# EAGLE design v2.0 Main (EAGLE 9.7.0)
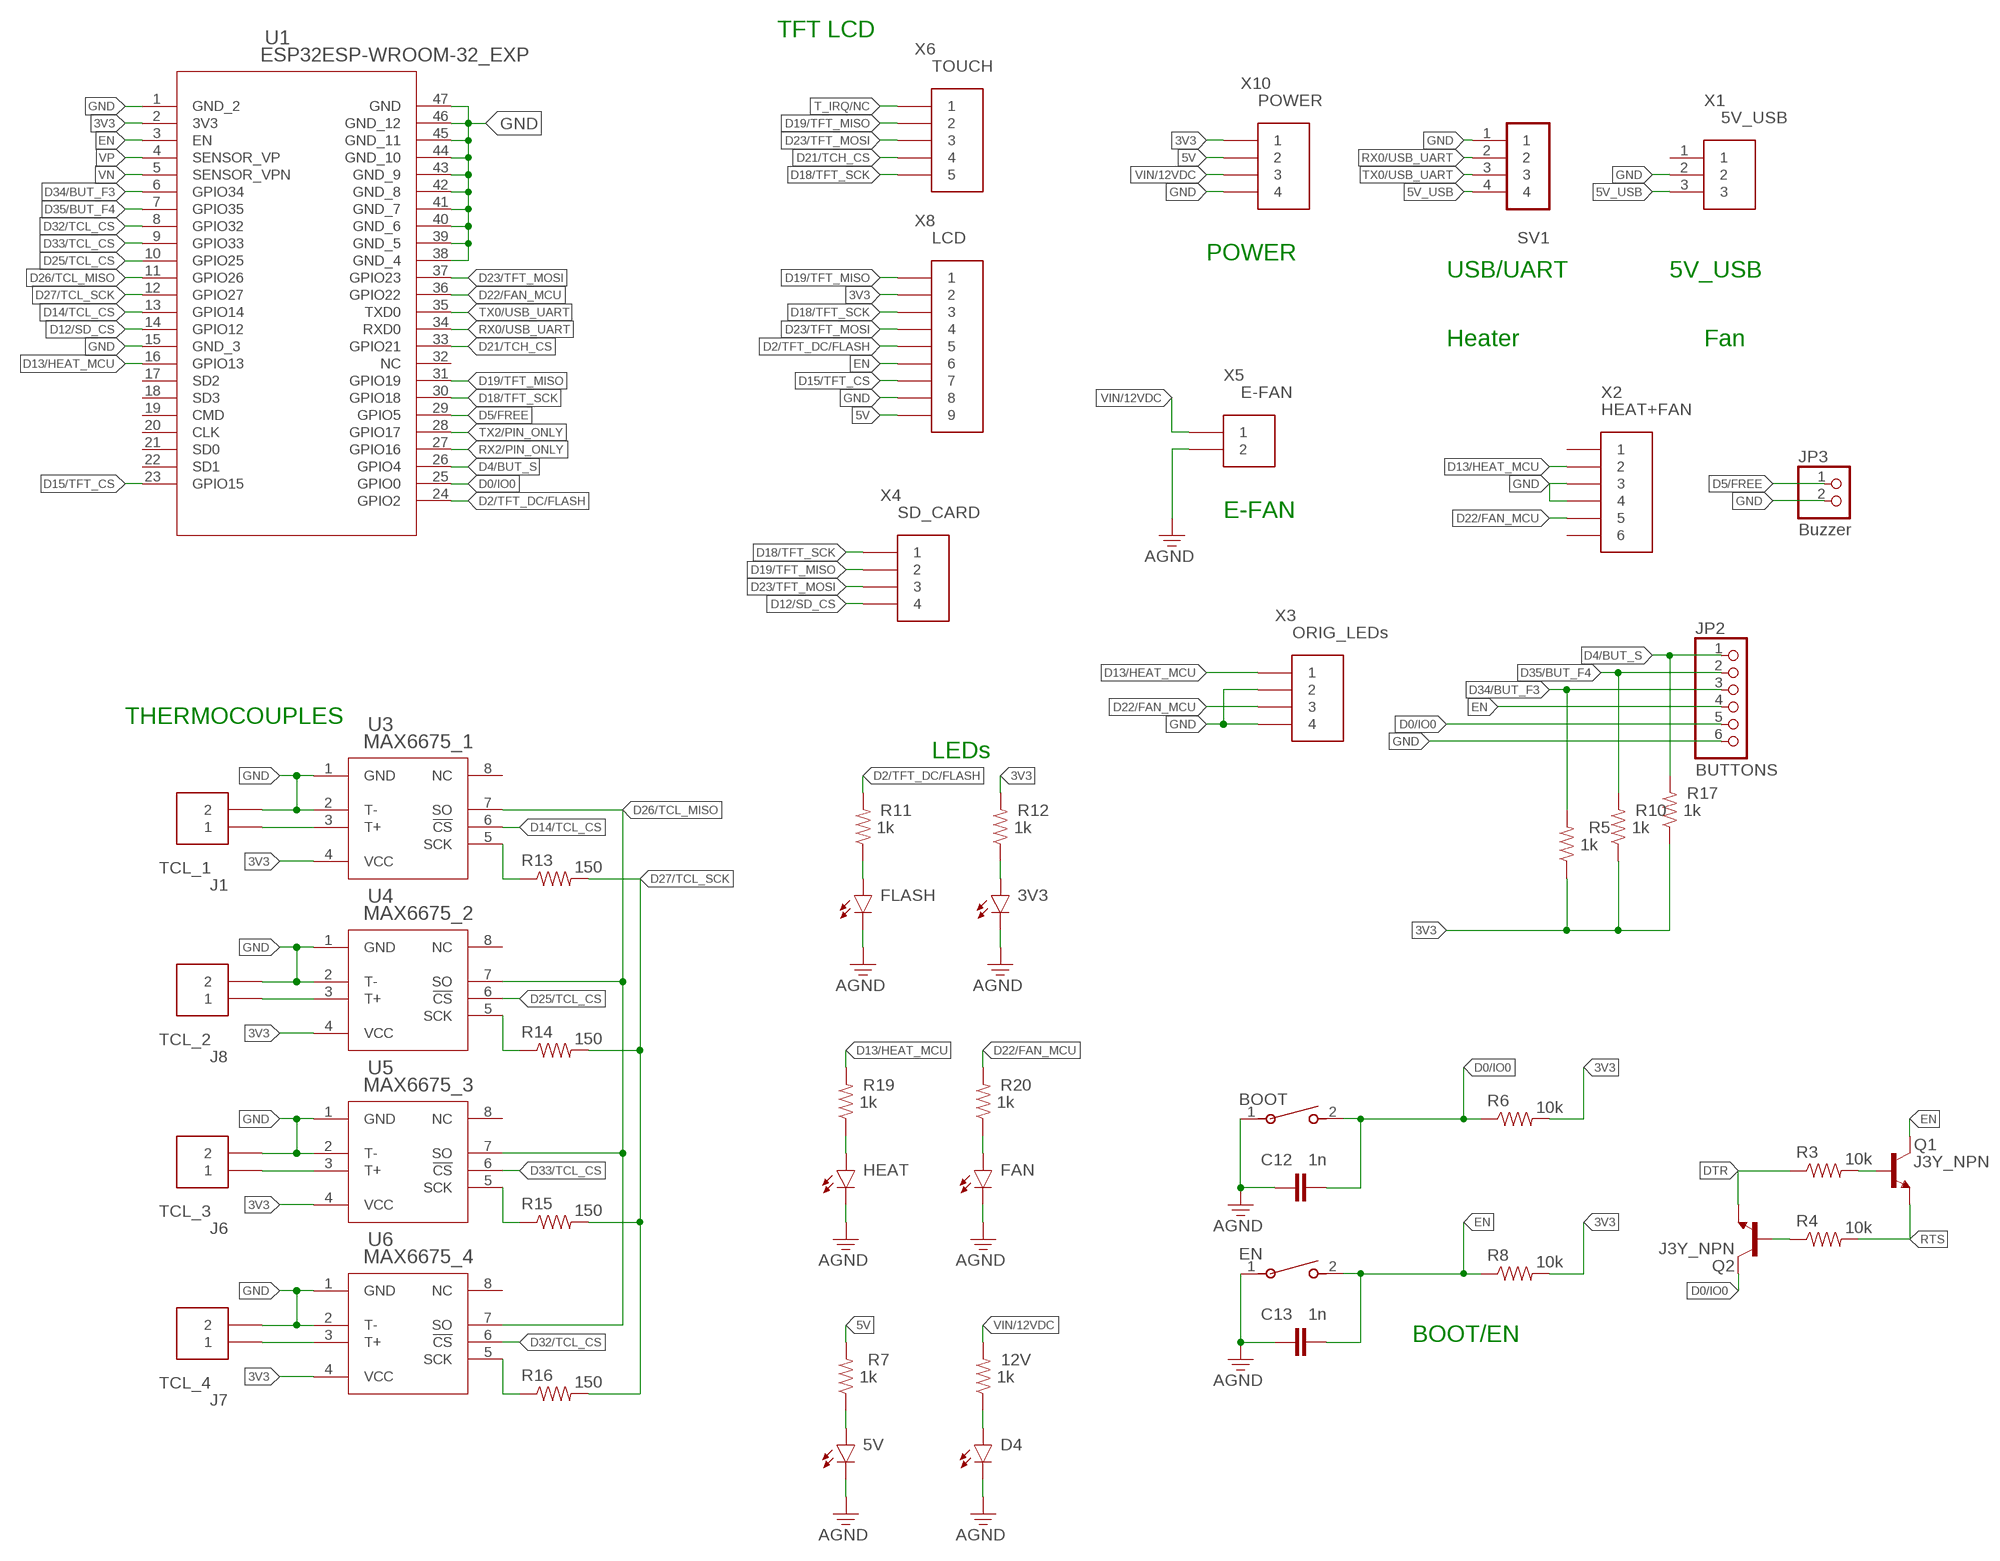
[diagram p0: schematic, sheet 1]

## Parts
3V3  LED  CHIP-FLAT-B_0805  [LEDC2012X110N_FLAT-B]
5V  LED  CHIP-FLAT-B_0805  [LEDC2012X110N_FLAT-B]
12V  1k  R-US_CHIP-0805(2012-METRIC)  [RESC2012X65]
BOOT  EVQ22705RSW_EVQ22705R_PAN  [SW_EVQ22705R_PAN]
C12  1n  C_CHIP-0805(2012-METRIC)  [CAPC2012X110]
C13  1n  C_CHIP-0805(2012-METRIC)  [CAPC2012X110]
D4  LED  CHIP-FLAT-B_0805  [LEDC2012X110N_FLAT-B]
EN  EVQ22705RSW_EVQ22705R_PAN  [SW_EVQ22705R_PAN]
FAN  LED  CHIP-FLAT-B_0805  [LEDC2012X110N_FLAT-B]
FLASH  LED  CHIP-FLAT-B_0805  [LEDC2012X110N_FLAT-B]
HEAT  LED  CHIP-FLAT-B_0805  [LEDC2012X110N_FLAT-B]
J1  TCL_1  OSTVN02A150CONN_OSTVN02A150_OST  [CONN_OSTVN02A150_OST]
J6  TCL_3  OSTVN02A150CONN_OSTVN02A150_OST  [CONN_OSTVN02A150_OST]
J7  TCL_4  OSTVN02A150CONN_OSTVN02A150_OST  [CONN_OSTVN02A150_OST]
J8  TCL_2  OSTVN02A150CONN_OSTVN02A150_OST  [CONN_OSTVN02A150_OST]
JP2  BUTTONS  PINHD-1X6  [1X06]
JP3  Buzzer  PINHD-1X2  [1X02]
Q1  J3Y_NPN  NPN_SC59-BEC  [SC59]
Q2  J3Y_NPN  NPN_SC59-BEC  [SC59]
R3  10k  R-US_CHIP-0805(2012-METRIC)  [RESC2012X65]
R4  10k  R-US_CHIP-0805(2012-METRIC)  [RESC2012X65]
R5  1k  R-US_CHIP-0805(2012-METRIC)  [RESC2012X65]
R6  10k  R-US_CHIP-0805(2012-METRIC)  [RESC2012X65]
R7  1k  R-US_CHIP-0805(2012-METRIC)  [RESC2012X65]
R8  10k  R-US_CHIP-0805(2012-METRIC)  [RESC2012X65]
R10  1k  R-US_CHIP-0805(2012-METRIC)  [RESC2012X65]
R11  1k  R-US_CHIP-0805(2012-METRIC)  [RESC2012X65]
R12  1k  R-US_CHIP-0805(2012-METRIC)  [RESC2012X65]
R13  150  R-US_CHIP-0805(2012-METRIC)  [RESC2012X65]
R14  150  R-US_CHIP-0805(2012-METRIC)  [RESC2012X65]
R15  150  R-US_CHIP-0805(2012-METRIC)  [RESC2012X65]
R16  150  R-US_CHIP-0805(2012-METRIC)  [RESC2012X65]
R17  1k  R-US_CHIP-0805(2012-METRIC)  [RESC2012X65]
R19  1k  R-US_CHIP-0805(2012-METRIC)  [RESC2012X65]
R20  1k  R-US_CHIP-0805(2012-METRIC)  [RESC2012X65]
SV1  FEM-HEAD  [FE05-1]
U1  ESP32ESP-WROOM-32_EXP  [ESP32_SCH_PCB]
U3  MAX6675_1  MAX6675_LARGE21-0041B_8_MXM  [21-0041B_8_MXM]
U4  MAX6675_2  MAX6675_LARGE21-0041B_8_MXM  [21-0041B_8_MXM]
U5  MAX6675_3  MAX6675_LARGE21-0041B_8_MXM  [21-0041B_8_MXM]
U6  MAX6675_4  MAX6675_LARGE21-0041B_8_MXM  [21-0041B_8_MXM]
X1  5V_USB  JST-XH-03-PIN-LONG-PAD  [JST-XH-03-PACKAGE-LONG-PAD]
X2  HEAT+FAN  JST-XH-06-PIN-LONG-PAD  [JST-XH-06-PACKAGE-LONG-PAD]
X3  ORIG_LEDs  JST-XH-04-PIN-LONG-PAD  [JST-XH-04-PACKAGE-LONG-PAD]
X4  SD_CARD  JST-XH-04-PIN-LONG-PAD  [JST-XH-04-PACKAGE-LONG-PAD]
X5  E-FAN  JST-XH-02-PIN-LONG-PAD  [-LONG-PAD]
X6  TOUCH  JST-XH-05-PIN-LONG-PAD  [JST-XH-05-PACKAGE-LONG-PAD]
X8  LCD  JST-XH-09-PIN-LONG-PAD  [JST-XH-09-PACKAGE-LONG-PAD]
X10  POWER  JST-XH-04-PIN-LONG-PAD  [JST-XH-04-PACKAGE-LONG-PAD]

## Nets
3V3: R5.1 R6.2 R8.2 R10.1 R12.2 R17.1 U1.2(3V3) U3.4(VCC) U4.4(VCC) U5.4(VCC) U6.4(VCC) X8.2 X10.1
5V: R7.2 X8.9 X10.2
5V_USB: SV1.4 X1.3
D0/IO0: BOOT.2 C12.2 JP2.5 Q2.C R6.1 U1.25(GPIO0)
D2/TFT_DC/FLASH: R11.2 U1.24(GPIO2) X8.5
D4/BUT_S: JP2.1 R17.2 U1.26(GPIO4)
D5/FREE: JP3.1 U1.29(GPIO5)
D12/SD_CS: U1.14(GPIO12) X4.4
D13/HEAT_MCU: R19.2 U1.16(GPIO13) X2.2 X3.1
D14/TCL_CS: U1.13(GPIO14) U3.6(!CS)
D15/TFT_CS: U1.23(GPIO15) X8.7
D18/TFT_SCK: U1.30(GPIO18) X4.1 X6.5 X8.3
D19/TFT_MISO: U1.31(GPIO19) X4.2 X6.2 X8.1
D21/TCH_CS: U1.33(GPIO21) X6.4
D22/FAN_MCU: R20.2 U1.36(GPIO22) X2.5 X3.3
D23/TFT_MOSI: U1.37(GPIO23) X4.3 X6.3 X8.4
D25/TCL_CS: U1.10(GPIO25) U4.6(!CS)
D26/TCL_MISO: U1.11(GPIO26) U3.7(SO) U4.7(SO) U5.7(SO) U6.7(SO)
D27/TCL_SCK: R13.2 R14.2 R15.2 R16.2 U1.12(GPIO27)
D32/TCL_CS: U1.8(GPIO32) U6.6(!CS)
D33/TCL_CS: U1.9(GPIO33) U5.6(!CS)
D34/BUT_F3: JP2.3 R5.2 U1.6(GPIO34)
D35/BUT_F4: JP2.2 R10.2 U1.7(GPIO35)
DTR: Q2.E R3.1
EN: C13.2 EN.2 JP2.4 Q1.C R8.1 U1.3(EN) X8.6
GND: 3V3.C 5V.C BOOT.1 C12.1 C13.1 D4.C EN.1 FAN.C FLASH.C HEAT.C J1.2 J6.2 J7.2 J8.2 JP2.6 JP3.2 SV1.1 U1.1(GND_2) U1.15(GND_3) U1.38(GND_4) U1.39(GND_5) U1.40(GND_6) U1.41(GND_7) U1.42(GND_8) U1.43(GND_9) U1.44(GND_10) U1.45(GND_11) U1.46(GND_12) U1.47(GND) U3.1(GND) U3.2(T-) U4.1(GND) U4.2(T-) U5.1(GND) U5.2(T-) U6.1(GND) U6.2(T-) X1.2 X2.3 X2.4 X3.2 X3.4 X5.2 X8.8 X10.4 ; supply symbol labelled AGND
N$1: FLASH.A R11.1
N$2: Q1.B R3.2
N$4: Q2.B R4.1
N$6: 3V3.A R12.1
N$7: 5V.A R7.1
N$8: 12V.1 D4.A
N$26: HEAT.A R19.1
N$27: FAN.A R20.1
RTS: Q1.E R4.2
RX0/USB_UART: SV1.2 U1.34(RXD0)
RX2/PIN_ONLY: U1.27(GPIO16)
T1: J1.1 U3.3(T+)
T2: J8.1 U4.3(T+)
T3: J6.1 U5.3(T+)
T4: J7.1 U6.3(T+)
T_IRQ/NC: X6.1
TCL_SCK1: R13.1 U3.5(SCK)
TCL_SCK2: R14.1 U4.5(SCK)
TCL_SCK3: R15.1 U5.5(SCK)
TCL_SCK4: R16.1 U6.5(SCK)
TX0/USB_UART: SV1.3 U1.35(TXD0)
TX2/PIN_ONLY: U1.28(GPIO17)
VIN/12VDC: 12V.2 X5.1 X10.3
VN: U1.5(SENSOR_VPN)
VP: U1.4(SENSOR_VP)
Unconnected: U1.17(SD2) U1.18(SD3) U1.19(CMD) U1.20(CLK) U1.21(SD0) U1.22(SD1) U1.32(NC) U3.8(NC) U4.8(NC) U5.8(NC) U6.8(NC) X1.1 X2.1 X2.6

## Notes on the sheet
- TFT LCD
- POWER
- USB/UART | 5V_USB
- Heater | Fan
- E-FAN
- THERMOCOUPLES
- LEDs
- BOOT/EN

## Library data of the parts
3V3 5V D4 FAN FLASH HEAT = LED:CHIP-FLAT-B: Blue LED - Generic; CATEGORY: LED; COLOR: Blue; DESCRIPTION: Blue LED Indication 0805 (2012 Metric); PACKAGE_SIZE: 0805; PACKAGE_TYPE: SMD; SUBCATEGORY: Chip LED; TYPE: Square with Flat Top
12V R3-R8 R10-R17 R19 R20 = Resistor:R-US: Resistor Fixed - ANSI; CATEGORY: Resistors; DESCRIPTION: Chip Resistor 2.00 X 1.25 X 0.65 mm body 0805(2012-METRIC) Package; PACKAGE_SIZE: 0805; PACKAGE_TYPE: SMD
BOOT EN = SD-SolderSync-Library:EVQ22705R; COPYRIGHT: Copyright (C) 2024 Ultra Librarian. All rights reserved.; MANUFACTURER_PART_NUMBER: EVQ-22705R; MFR_NAME: Panasonic
C12 C13 = Capacitor:C: Capacitor - Generic; CATEGORY: Capacitor; PACKAGE_SIZE: 0805; PACKAGE_TYPE: SMD; SUBCATEGORY: Ceramic Capacitors; TYPE: MLCC
J1 J6-J8 = Connectors:OSTVN02A150; COPYRIGHT: Copyright (C) 2025 Ultra Librarian. All rights reserved.; MANUFACTURER_PART_NUMBER: OSTVN02A150; MFR_NAME: On Shore Technology
JP2 = Connector:PINHD-1X6: PIN HEADER; CATEGORY: Headers; DESCRIPTION: Header-Straight-6 Position; PACKAGE_TYPE: THT; PITCH: 0.100" (2.54mm); SUBCATEGORY: Headers-Male Pins; TYPE: Board to Board or Cable-Unshrouded-Through Hole-Straight
JP3 = Connector:PINHD-1X2: PIN HEADER; CATEGORY: Headers; DESCRIPTION: Header-Straight-2 Position; PACKAGE_TYPE: THT; PITCH: 0.100" (2.54mm); SUBCATEGORY: Headers-Male Pins; TYPE: Board to Board or Cable-Unshrouded-Through Hole-Straight
Q1 Q2 = Transistor:NPN: NPN - Generic; CATEGORY: Transistor; SUB-CATEGORY: BJT; TYPE: NPN; VALUE: NPN
SV1 = Connectors:FEM-HEAD: FEMALE HEADER; OC_FARNELL: unknown; OC_NEWARK: unknown
U1 = SD-SolderSync-Library:ESP32; COPYRIGHT: Copyright (C) 2024 Ultra Librarian. All rights reserved.; MANUFACTURER_PART_NUMBER: ESP-WROOM-32; MFR_NAME: Espressif Systems
U3-U6 = SD-SolderSync-Library:MAX6675_LARGE; COPYRIGHT: Copyright (C) 2025 Ultra Librarian. All rights reserved.; MANUFACTURER_PART_NUMBER: max6675isa+T; MFR_NAME: Analog Devices Inc
X1 = Connectors:JST-XH-03-PIN: JST XH Connector 2 Pin Wire to board connector. Pitch: 2,54 mm, (0.100") Number of pins: 3 Created by Rembrandt Electronics www.rembrandtelectronics.com
X2 = Connectors:JST-XH-06-PIN: JST XH Connector 2 Pin Wire to board connector. Pitch: 2,54 mm, (0.100") Number of pins: 6 Created by Rembrandt Electronics www.rembrandtelectronics.com
X3 X4 X10 = Connectors:JST-XH-04-PIN: JST XH Connector 2 Pin Wire to board connector. Pitch: 2,54 mm, (0.100") Number of pins: 4 Created by Rembrandt Electronics www.rembrandtelectronics.com
X5 = Connectors:JST-XH-02-PIN: JST XH Connector 2 Pin Wire to board connector. Pitch: 2,54 mm, (0.100") Number of pins: 2 Created by Rembrandt Electronics www.rembrandtelectronics.com
X6 = Connectors:JST-XH-05-PIN: JST XH Connector 2 Pin Wire to board connector. Pitch: 2,54 mm, (0.100") Number of pins: 5 Created by Rembrandt Electronics www.rembrandtelectronics.com
X8 = Connectors:JST-XH-09-PIN: JST XH Connector 2 Pin Wire to board connector. Pitch: 2,54 mm, (0.100") Number of pins: 9 Created by Rembrandt Electronics www.rembrandtelectronics.com

## Board
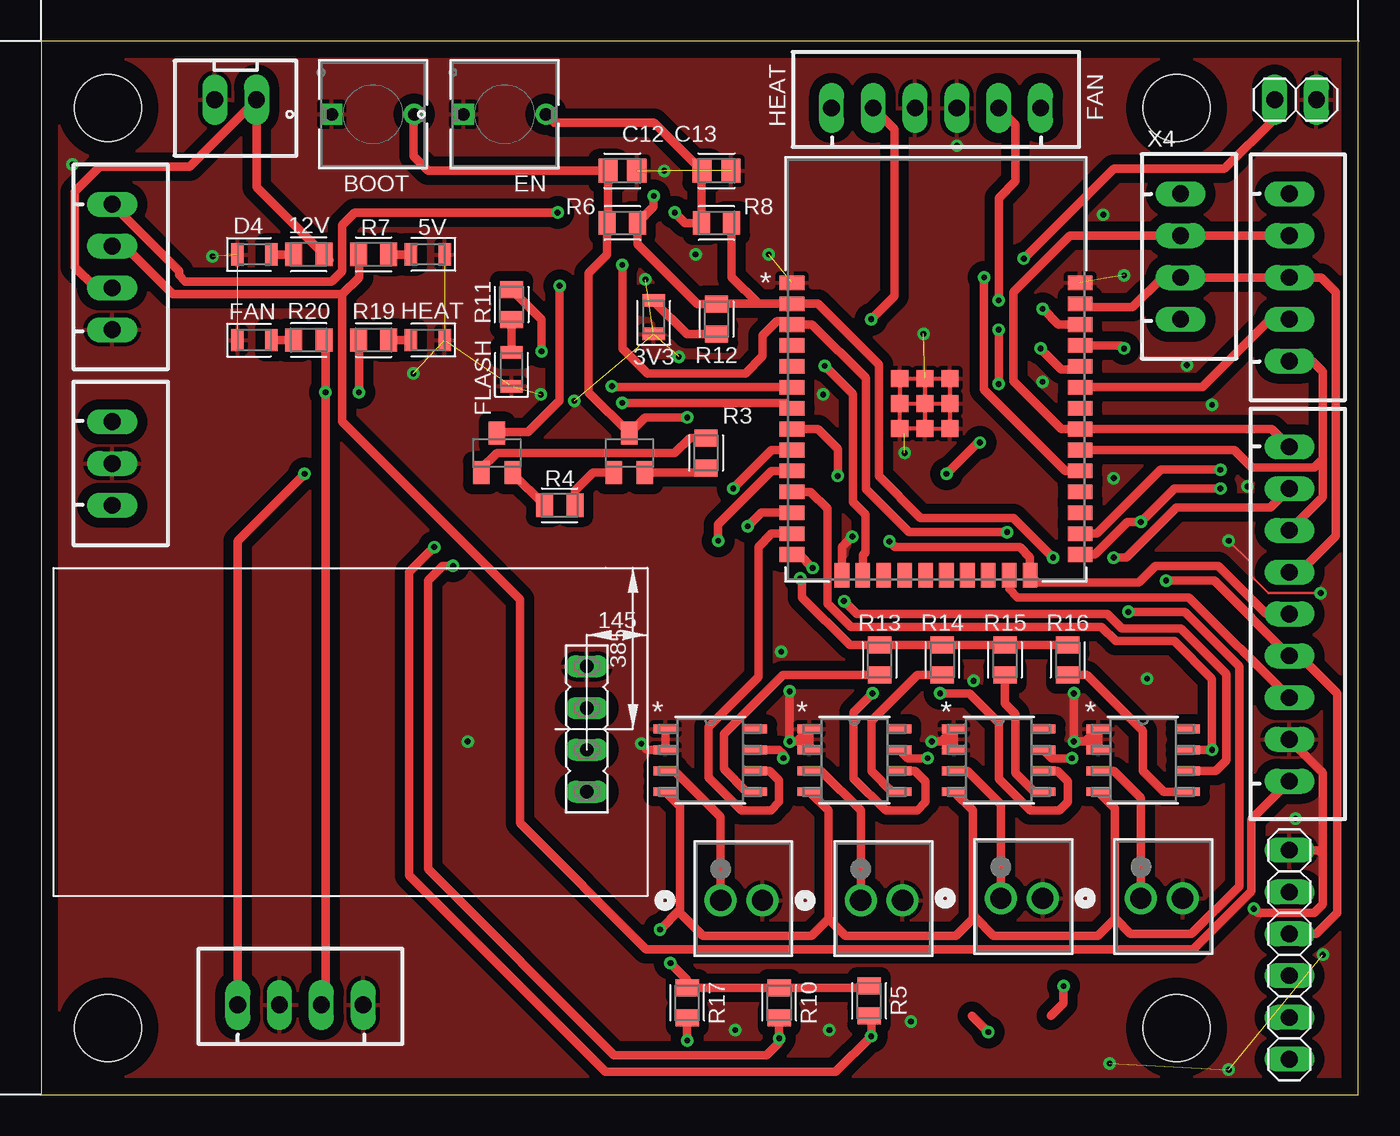
[diagram p1: board, top side]
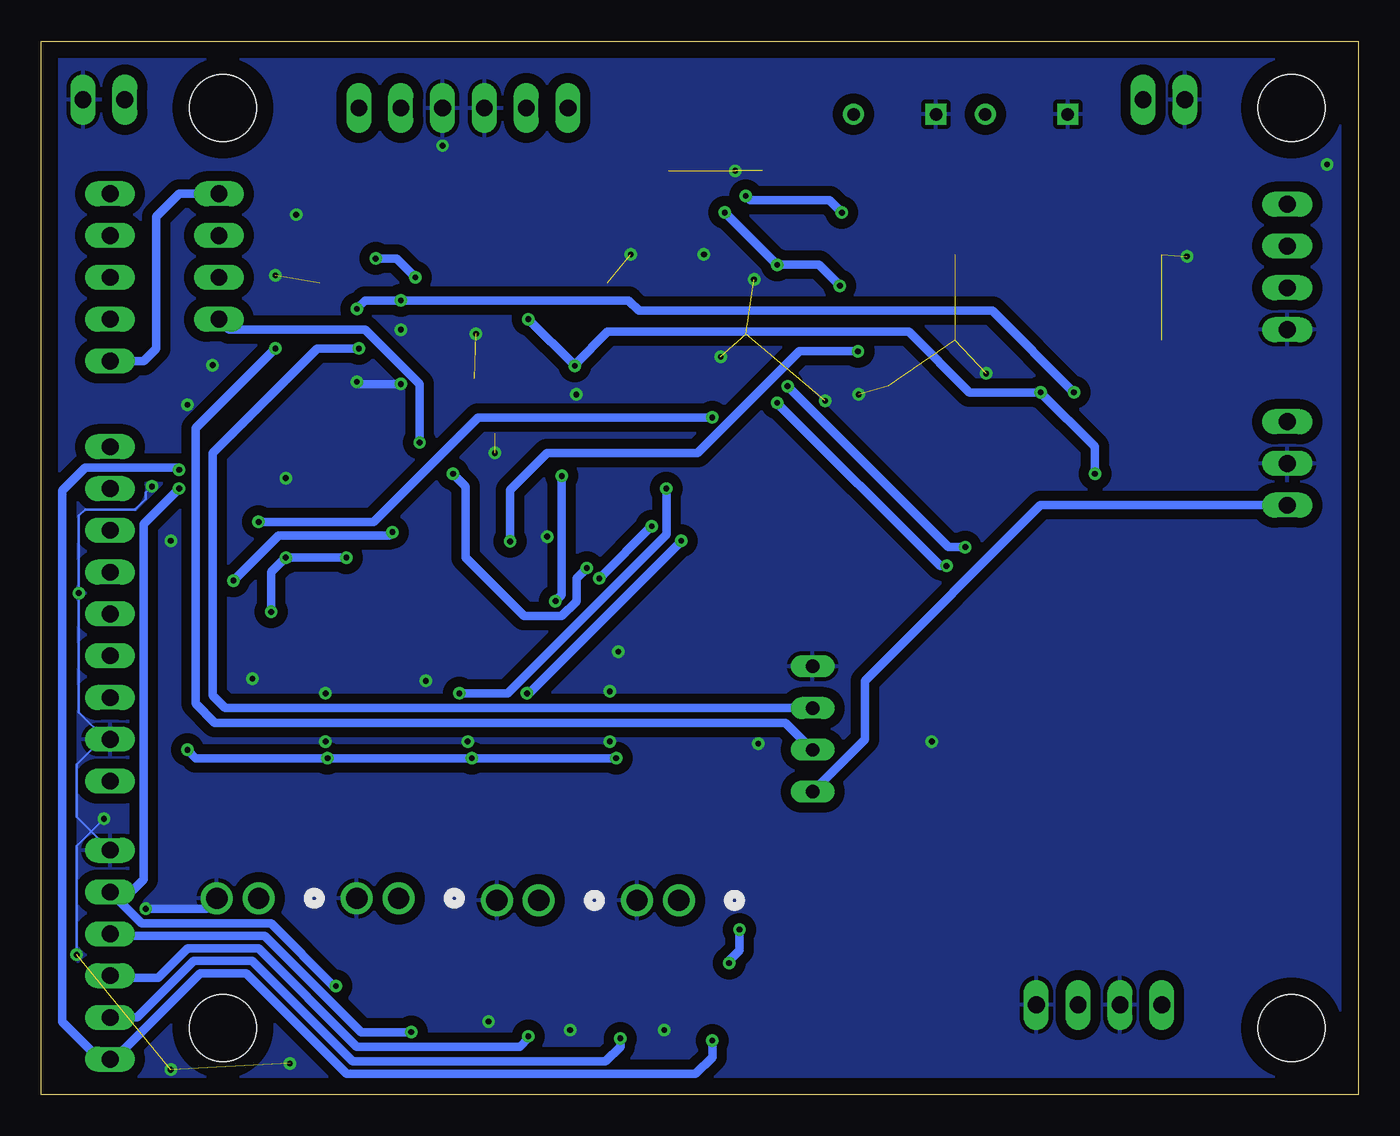
[diagram p2: board, bottom side, seen from below]

Size 80.01 x 64.01 mm. Coordinates in mm from the lower left corner, seen from the top.
Outline: 0,0 80.01,0 80.01,64.01 0,64.01 0,0
Copper layers (1*16): Top 0.035mm / dielectric 1.5mm / Bottom 0.035mm
Design rules "Fusion Electronics Design Rules": minimum track width 6mil, minimum drill 0.35mm, track to track 6mil, track to pad 6mil, pad to pad 6mil, via to via 6mil, smd to smd 6mil, copper to edge 40mil, drill to drill 6mil, minimum pad ring 10mil, minimum via ring 8mil, stop-mask expansion 4mil, vias tented up to drill 0mil, thermal gap 10mil
Holes 4.06 mm at 4.06,4.06 68.96,4.06 68.96,59.94 4.06,59.94

### Footprints (pad centres in the part's own frame; a part is rotated, then mirrored left to right if it is on the bottom)
LEDC2012X110N_FLAT-B = smd 0.762 x 1.362: A 1.025,0; C -1.025,0
RESC2012X65 = smd 1.031 x 1.42: 1 -0.919,0; 2 0.919,0
SW_EVQ22705R_PAN = drill 0.762 pad 1.27 square: 1 0,0 | drill 0.762 pad 1.27: 2 5.004,0
CAPC2012X110 = smd 1.165 x 1.465: 1 -0.875,0; 2 0.875,0
CONN_OSTVN02A150_OST = drill 1.295 pad 1.803: 1 0,0; 2 2.54,0
1X06 = drill 1.016 long: 1 -6.35,0; 2 -3.81,0; 3 -1.27,0; 4 1.27,0; 5 3.81,0; 6 6.35,0
1X02 = drill 1.016 long: 1 -1.27,0; 2 1.27,0
SC59 = smd 1 x 1.4: B -0.95,-1.2; C 0,1.2; E 0.95,-1.2
FE05-1 = drill 0.813 long: 1 -5.08,0; 2 -2.54,0; 3 0,0; 4 2.54,0
ESP32_SCH_PCB = smd 1.499 x 0.889: 1 -8.75,5.26; 2 -8.75,3.99; 3 -8.75,2.72; 4 -8.75,1.45; 5 -8.75,0.18; 6 -8.75,-1.09; 7 -8.75,-2.36; 8 -8.75,-3.63; 9 -8.75,-4.9; 10 -8.75,-6.17; 11 -8.75,-7.44; 12 -8.75,-8.71; 13 -8.75,-9.98; 14 -8.75,-11.25; 25 8.75,-11.25; 26 8.75,-9.98; 27 8.75,-8.71; 28 8.75,-7.44; 29 8.75,-6.17; 30 8.75,-4.9; 31 8.75,-3.63; 32 8.75,-2.36; 33 8.75,-1.09; 34 8.75,0.18; 35 8.75,1.45; 36 8.75,2.72; 37 8.75,3.99; 38 8.75,5.26 | smd 0.889 x 1.499: 15 -5.715,-12.501; 16 -4.445,-12.501; 17 -3.175,-12.501; 18 -1.905,-12.501; 19 -0.635,-12.501; 20 0.635,-12.501; 21 1.905,-12.501; 22 3.175,-12.501; 23 4.445,-12.501; 24 5.715,-12.501 | smd 1.041 x 1.041: 39 -0.681,-2.08; 40 -2.205,-0.556; 41 -2.205,-2.08; 42 -2.205,-3.604; 43 -0.681,-3.604; 44 0.843,-3.604; 45 0.843,-2.08; 46 0.843,-0.556; 47 -0.681,-0.556
21-0041B_8_MXM = smd 1.46 x 0.533: 1 -2.724,1.905; 2 -2.724,0.635; 3 -2.724,-0.635; 4 -2.724,-1.905; 5 2.724,-1.905; 6 2.724,-0.635; 7 2.724,0.635; 8 2.724,1.905
JST-XH-03-PACKAGE-LONG-PAD = drill 1.016 long: 1 -2.54,0; 2 0,0; 3 2.54,0
JST-XH-06-PACKAGE-LONG-PAD = drill 1.016 long: 1 -6.35,0; 2 -3.81,0; 3 -1.27,0; 4 1.27,0; 5 3.81,0; 6 6.35,0
JST-XH-04-PACKAGE-LONG-PAD = drill 1.016 long: 1 -3.81,0; 2 -1.27,0; 3 1.27,0; 4 3.81,0
-LONG-PAD = drill 1.016 long: 1 -1.27,0; 2 1.27,0
JST-XH-05-PACKAGE-LONG-PAD = drill 1.016 long: 1 -5.08,0; 2 -2.54,0; 3 0,0; 4 2.54,0; 5 5.08,0
JST-XH-09-PACKAGE-LONG-PAD = drill 1.016 long: 1 -10.16,0; 2 -7.62,0; 3 -5.08,0; 4 -2.54,0; 5 0,0; 6 2.54,0; 7 5.08,0; 8 7.62,0; 9 10.16,0

### Placement (x,y rotation side)
3V3  37.21,47.24 90 top
5V  23.5,51.05 180 top
12V  16.26,51.05 0 top
BOOT  17.65,59.56 0 top
C12  35.31,56.13 180 top
C13  41.02,56.13 180 top
D4  12.95,51.05 0 top
EN  25.65,59.56 0 top
FAN  12.95,45.85 0 top
FLASH  28.57,44.07 90 top
HEAT  23.5,45.85 180 top
J1  41.27,11.81 0 top
J6  58.29,11.94 0 top
J7  66.8,11.94 0 top
J8  49.78,11.81 0 top
JP2  75.82,8.51 90 top
JP3  76.2,60.45 0 top
Q1  27.69,38.99 0 top
Q2  35.73,38.99 0 top
R3  40.39,38.99 90 top
R4  31.5,35.81 180 top
R5  50.29,5.71 270 top
R6  35.31,52.96 0 top
R7  20.19,51.05 180 top
R8  41.02,52.96 0 top
R10  44.83,5.59 270 top
R11  28.57,48.01 90 top
R12  41.02,47.12 90 top
R13  50.93,26.42 90 top
R14  54.74,26.42 90 top
R15  58.55,26.42 90 top
R16  62.36,26.42 90 top
R17  39.24,5.59 270 top
R19  20.19,45.85 180 top
R20  16.26,45.85 0 top
SV1  33.15,20.95 270 top
U1  54.36,44.07 0 top
U3  40.64,20.32 0 top
U4  49.4,20.32 0 top
U5  58.17,20.32 0 top
U6  66.93,20.32 0 top
X1  4.32,38.35 270 top
X2  54.36,59.94 0 top
X3  15.75,5.46 0 top
X4  69.22,50.93 270 top
X5  11.81,60.45 180 top
X6  75.82,49.66 270 top
X8  75.82,29.21 270 top
X10  4.32,50.29 270 top

### Tracks (layer width: path | path; a pad name or v marks a point on that pad's centre or on a via)
3V3  (via drill 0.35)
  Top 0.254: 45.29,48.06 U1.2
  Top 0.508: v61.47,32.64 59.05,35.05 53.41,35.05 50.88,37.58 50.88,44.37 47.19,48.06 U1.2 43.56,48.06 | 43.56,48.06 41.04,48.06 R12.2 39.88,48.04 36.23,51.69 R6.2 37.21,53.94 v37.21,54.61 | R8.2 41.94,49.68 43.56,48.06 | v65.15,32.64 65.91,32.64 68.96,35.69 74.68,35.69 X8.2 | 47.83,10.7 46.8,9.67 40.2,9.67 38.81,11.06 38.81,11.25 | 56.59,10.7 55.56,9.67 48.86,9.67 47.83,10.7 | 65.23,10.7 64.2,9.67 57.85,9.67 56.72,10.8 56.59,10.7 | 65.23,10.7 65.24,10.71 66.17,9.78 69.88,9.78 72.77,12.68 72.77,26.04 69.47,29.34 v66.04,29.34 | 38.81,11.25 38.81,17.52 U3.4 | 65.23,10.7 65.23,17.39 U6.4 | 56.59,10.7 56.59,17.27 U5.4 | 47.83,10.7 47.83,17.27 U4.4 | X10.1 8.38,50.04 8.38,49.78 8.76,49.4 17.65,49.4 18.29,50.04 18.29,52.83 19.05,53.59 v31.37,53.59 | v38.23,8 39.24,6.99 R17.1 R10.1 50.16,6.51 R5.1 | v37.59,10.03 38.81,11.25
  Bottom 0.508: v61.47,32.64 v65.15,32.64 66.04,31.75 v66.04,29.34 | v37.21,54.61 36.96,54.36 32.13,54.36 v31.37,53.59 | v37.59,10.03 37.59,8.76 38.23,8.13 v38.23,8
5V
  Top 0.508: X8.9 73.51,16.74 73.51,12.37 69.98,8.84 36.75,8.84 29.08,16.51 29.08,30.1 18.29,40.89 18.29,48.64 | 18.29,48.64 8,48.64 5.08,51.56 X10.2 | 18.29,48.64 19.3,49.66 19.3,51.02 R7.2
5V_USB
  Bottom 0.508: SV1.4 29.97,21.59 29.97,25.15 19.3,35.81 X1.3
D0/IO0  (via drill 0.35)
  Top 0.508: BOOT.2 22.62,59.53 22.62,57.02 23.51,56.13 C12.2 34.43,53 R6.1 34.39,51.05 33.26,49.93 33.26,42.66 Q2.C 36.69,41.15 v39.24,41.15 | U1.25 63.99,32.82 65.97,34.8 v66.8,34.8 68.83,36.83 v71.63,36.83 | v62.1,6.6 62.1,5.56 61.34,4.79
  Bottom 0.508: v66.8,34.8 59.82,34.8 53.47,41.15 v39.24,41.15 | v71.63,36.83 73.79,34.67 73.79,13.08 74.55,12.32 JP2.5 73.91,10.41 66.04,10.41 62.23,6.6 v62.1,6.6
D2/TFT_DC/FLASH  (via drill 0.35)
  Top 0.254: 60.07,32 U1.24
  Top 0.508: U1.24 60.52,31.11 66.67,31.11 67.69,32.13 71.5,32.13 74.42,29.21 X8.5 | v51.53,33.62 51.87,33.27 59.44,33.27 60.07,32.64 60.07,32 | v30.4,45.17 30.4,47.1 R11.2
  Bottom 0.508: v30.4,45.17 33.95,45.17 40.13,38.99 49.28,38.99 51.53,36.74 v51.53,33.62
D4/BUT_S  (via drill 0.35)
  Top 0.508: U1.26 64.12,34.09 68.01,37.97 v71.63,37.97 | v39.24,3.3 R17.2
  Bottom 0.508: v71.63,37.97 71.75,38.1 77.34,38.1 78.74,36.7 78.74,4.45 76.45,2.16 JP2.1 75.56,2.16 70.36,7.37 67.56,7.37 61.47,1.27 40.26,1.27 39.24,2.29 v39.24,3.3
D5/FREE  (via drill 0.35)
  Top 0.508: U1.29 62.22,37.9 57.28,42.84 v57.28,49.66 | v59.69,50.8 65.15,56.26 71.88,56.26 74.93,59.31 JP3.1
  Bottom 0.508: v57.28,49.66 58.42,50.8 v59.69,50.8
D12/SD_CS  (via drill 0.35)
  Top 0.508: U1.14 46.05,32.82 v46.86,32 | v54.99,37.72 56.9,39.62 v57.02,39.62
  Bottom 0.508: v46.86,32 47.5,31.37 47.5,29.97 48.39,29.08 50.67,29.08 54.23,32.64 54.23,36.96 v54.99,37.72 | v57.02,39.62 57.02,43.18 60.33,46.48 68.58,46.48 X4.4
D13/HEAT_MCU  (via drill 0.35)
  Top 0.508: v50.42,47.12 51.82,48.51 51.82,58.67 X2.2 | v47.59,44.29 49.3,42.58 49.3,36.02 50.06,35.26 50.06,32.95 49.91,32.8 U1.16 | R19.2 19.3,45.82 v19.3,42.67 | X3.1 11.94,33.66 v16,37.72
  Bottom 0.508: v50.42,47.12 v50.42,47.11 v47.59,44.29 47.59,44.35 45.59,46.35 27.3,46.35 23.62,42.67 v19.3,42.67 16,39.37 v16,37.72
D14/TCL_CS
  Top 0.508: U1.13 44.38,34.09 43.56,33.27 43.56,25.37 40.54,22.35 40.54,19.28 42.55,17.27 44.32,17.27 44.83,17.78 44.83,19.11 44.25,19.68 U3.6
D15/TFT_CS
  Top 0.508: U1.23 58.8,30.73 59.31,30.23 69.72,30.23 X8.7
D18/TFT_SCK
  Top 0.254: 75.82,34.59 X8.3
  Top 0.508: U1.30 72.46,39.17 73.53,38.1 77.34,38.1 77.85,38.61 | 77.85,38.61 77.85,43.94 77.22,44.58 X6.5 | 77.85,38.61 77.85,36.32 X8.3
  Bottom 0.508: X4.1 71.63,54.74 73.03,53.34 73.03,45.34 73.79,44.58 X6.5
D19/TFT_MISO
  Top 0.508: X8.1 74.75,40.44 U1.31 61.98,40.44 59.05,43.36 59.05,48.77 62.48,52.2 X4.2 X6.2
D21/TCH_CS
  Top 0.508: U1.33 70.54,42.98 74.68,47.12 X6.4
D22/FAN_MCU  (via drill 0.35)
  Top 0.508: U1.36 61.8,46.79 v60.83,47.75 | v58.17,48.26 58.17,54.48 59.18,55.5 59.18,58.93 X2.5 | R20.2 17.27,45.75 v17.27,42.67 17.27,5.71 X3.3
  Bottom 0.508: v60.83,47.75 60.33,48.26 v58.17,48.26 44.32,48.26 43.69,47.62 22.23,47.62 v17.27,42.67
D23/TFT_MOSI
  Top 0.508: X8.4 76.45,31.75 78.64,33.93 78.64,48.77 77.75,49.66 X6.3 X4.3 68.11,49.66 66.29,47.84 63.32,47.84 U1.37
D25/TCL_CS  (via drill 0.35)
  Top 0.508: U1.10 44.38,37.9 41.12,34.65 v41.12,33.66 | v50.5,24.38 49.35,23.24 49.35,19.23 51.31,17.27 53.21,17.27 53.72,17.78 53.72,19.05 53.09,19.68 U4.6
  Bottom 0.508: v41.12,33.66 41.11,33.64 50.37,24.38 v50.5,24.38
D26/TCL_MISO  (via drill 0.35)
  Top 0.508: U1.11 46.74,36.63 47.75,35.62 47.75,29.84 49.17,28.42 64.41,28.42 65.28,27.56 68.83,27.56 71.12,25.27 v71.12,20.95 U6.7 | v45.09,20.45 45.09,20.7 44.83,20.95 U3.7 | v62.61,20.45 61.4,20.45 U5.7 | v53.85,20.45 52.63,20.45 U4.7
  Bottom 0.508: v45.09,20.45 v53.85,20.45 v62.61,20.45 70.61,20.45 v71.12,20.95
D27/TCL_SCK  (via drill 0.35)
  Top 0.508: R16.2 R15.2 R14.2 R13.2 49.12,27.34 46.23,30.23 46.23,31.24 v46.1,31.37 | U1.12 43.74,35.36 v42.93,34.54
  Bottom 0.508: v42.93,34.54 v46.1,31.37
D32/TCL_CS  (via drill 0.35)
  Top 0.508: U1.8 47.19,40.44 48.39,39.24 v48.39,37.59 | v48.77,29.99 49.55,29.21 64.77,29.21 65.66,28.32 69.22,28.32 71.98,25.55 71.98,20.32 71.35,19.68 U6.6
  Bottom 0.508: v48.77,29.99 48.39,30.37 v48.39,37.59
D33/TCL_CS  (via drill 0.35)
  Top 0.508: U1.9 44.38,39.17 v42.04,36.83 | v54.61,24.38 56.39,24.38 58.17,22.61 58.17,19.18 60.08,17.27 61.85,17.27 62.36,17.78 62.36,19.05 61.72,19.68 U5.6
  Bottom 0.508: v42.04,36.83 42.04,34.04 51.69,24.38 v54.61,24.38
D34/BUT_F3  (via drill 0.35)
  Top 0.508: R5.2 50.42,4.67 v50.42,3.56 48.26,1.4 34.29,1.4 22.35,13.34 22.35,31.75 v23.88,33.27 | U1.6 34.74,42.98 v34.67,43.05
  Bottom 0.508: JP2.3 75.69,7.11 72.9,7.11 71.12,8.89 66.8,8.89 60.83,2.92 50.93,2.92 50.42,3.43 v50.42,3.56 | v34.67,43.05 24.89,33.27 v23.88,33.27
D35/BUT_F4  (via drill 0.35)
  Top 0.508: 46.12,41.71 U1.7 45.28,42.04 v35.31,42.04 | 44.86,4.7 R10.2 v44.83,3.43 44.83,3.17 44.07,2.41 34.8,2.41 23.5,13.72 23.5,31.24 24.38,32.13 v25.02,32.13
  Bottom 0.508: JP2.2 74.17,4.7 70.74,8.13 67.18,8.13 61.09,2.03 45.72,2.03 44.83,2.92 v44.83,3.43 | v35.31,42.04 25.4,32.13 v25.02,32.13
DTR
  Top 0.508: Q2.E 40.1,37.79 R3.1
EN  (via drill 0.35)
  Top 0.254: R8.1 40.39,52.67
  Top 0.508: v68.33,31.24 71.25,31.24 X8.6 75.95,26.54 76.58,26.54 78.74,24.38 78.74,11.05 77.47,9.78 JP2.4 | v58.67,34.19 52.7,34.19 50.09,36.8 50.09,43.54 46.84,46.79 U1.3 45.39,47.01 44.69,47.01 43.81,46.13 43.81,44.86 42.77,43.81 36.83,43.81 35.31,45.34 v35.31,50.42 | EN.2 31.17,59.05 37.23,59.05 C13.2 40.1,56.09 R8.1 39.12,52.96 v38.48,53.59 | Q1.C 27.76,40.26 29.59,40.26 31.5,42.16 v31.5,49.15 | v57.53,3.81 56.55,4.79
  Bottom 0.508: v31.5,49.15 32.77,50.42 v35.31,50.42 v38.48,53.59 | v58.67,34.19 58.88,33.98 65.58,33.98 v68.33,31.24 | JP2.4 75.69,9.65 66.42,9.65 60.58,3.81 v57.53,3.81
GND  (via drill 0.35)  (17 unrouted)
  Top 0.152: v72.14,33.66 73.41,32.38 73.41,31.62 74.55,30.48 v77.72,30.48
  Top 0.254: U1.40 U1.47 | U1.47 U1.46 U1.45 | U1.45 U1.44 U1.43 | U1.47 U1.39 | U1.40 U1.41 | U1.43 U1.42 | U1.42 U1.41 | U1.39 U1.43 | U1.41 U1.39 | U1.39 U1.45 | U1.40 52.15,43.73 | U1.42 52.45,40.16
  Top 0.508: v49.28,33.91 48.64,33.27 U1.15 | U3.1 U3.2 36.83,20.95 v36.45,21.34 | v62.74,21.46 63.44,21.46 U6.1 U6.2 63.7,21.46 v62.74,21.46 | v45.47,21.46 45.92,21.46 U4.1 U4.2 46.17,21.46 v45.47,21.46 | v58.17,46.48 v58.17,43.18 | X8.8 77.85,19.56 77.85,14.61 | 77.85,14.61 77.85,11.56 77.34,11.05 73.91,11.05 v73.66,11.3 | JP2.6 77.6,14.86 77.85,14.61 | v45.47,21.46 v45.47,24.51 | v62.74,24.38 v62.74,21.46 | U5.1 U5.2 54.93,21.46 v54.1,21.46 54.68,21.46 U5.1
  Bottom 0.152: v73.28,36.96 73.66,36.58 73.66,36.2 74.3,35.56 77.34,35.56 77.72,35.18 77.72,23.24 76.07,21.59 X8.8 76.33,21.59 77.85,20.07 77.85,16.89 JP2.6 | v76.2,16.76 77.85,15.11 v77.85,8.51
  Bottom 0.508: v58.17,43.18 60.71,43.18 v60.83,43.31 | v73.66,11.3 69.98,11.3 J7.2
  other vias: 55.63,57.66 65.79,49.78 44.2,51.05 37.85,56.13 52.45,38.99 39.75,51.05 25.91,21.46 42.16,3.94 47.88,3.94 52.83,4.45 67.18,25.27 65.15,37.47 53.59,46.23 47.5,42.55 32.38,42.16 1.91,56.52 64.9,1.91 72.14,1.52 22.61,43.81 44.96,26.92 64.52,53.47 69.6,44.32 71.12,41.91 56.64,25.15 30.35,42.55 10.41,50.93 36.7,49.53 38.73,44.83
  pour Top (isolate 0.61): -1.19,-1.19 80.95,-1.19 80.95,81.2 -1.19,81.2
  pour Bottom (isolate 0.61): -2.46,-2.46 81.84,-2.46 81.84,82.47 -2.46,82.47
N$1
  Top 0.508: R11.1 FLASH.A
N$2
  Top 0.508: Q1.B 26.74,38.04 27.69,38.99 38.48,38.99 39.4,39.91 R3.2
N$4
  Top 0.508: Q2.B 33.51,37.79 32.42,36.7 R4.1
N$6
  Top 0.508: 3V3.A 37.21,48.23 39.24,46.2 R12.1
N$7
  Top 0.508: 5V.A R7.1
N$8
  Top 0.508: D4.A 12V.1
N$26
  Top 0.508: R19.1 HEAT.A
N$27
  Top 0.508: FAN.A R20.1 15.36,45.85
RTS
  Top 0.254: Q1.E 28.96,37.47
  Top 0.508: R4.2 28.64,37.76 Q1.E
RX0/USB_UART  (via drill 0.35)
  Top 0.508: U1.34 62.93,44.07 61.98,44.07 v60.71,45.34
  Bottom 0.508: v60.71,45.34 63.25,45.34 69.6,38.99 69.6,24.26 68.83,23.5 SV1.2
T1
  Top 0.508: J1.1 41.27,16.87 38.46,19.68 U3.3
T2
  Top 0.508: J8.1 49.78,17.27 47.37,19.68 U4.3
T3
  Top 0.508: J6.1 58.29,17.65 56.26,19.68 U5.3
T4
  Top 0.508: J7.1 66.8,18.03 65.15,19.68 U6.3
TCL_SCK1
  Top 0.508: R13.1 45.05,25.5 41.49,21.93 41.49,19.78 42.86,18.41 U3.5
TCL_SCK2
  Top 0.508: R14.1 53.21,25.5 50.42,22.7 50.42,19.68 51.69,18.41 U4.5
TCL_SCK3
  Top 0.508: R15.1 58.55,23.77 59.18,23.13 59.18,19.56 60.33,18.41 U5.5
TCL_SCK4
  Top 0.508: R16.1 63.53,25.5 66.93,22.1 66.93,19.68 68.2,18.41 U6.5
TX0/USB_UART  (via drill 0.35)
  Top 0.508: U1.35 65.61,45.52 v65.79,45.34
  Bottom 0.508: v65.79,45.34 65.81,45.34 70.64,40.51 70.64,23.77 69.47,22.61 34.8,22.61 SV1.3
VIN/12VDC
  Top 0.508: 17.53,50.7 12V.2 13.08,55.15 X5.1 9.02,56.39 3.56,56.39 2.03,54.86 2.03,50.29 3.3,49.02 X10.3

### Text on the board
tPlace: MAIN v1.1 | HEAT | FAN